# Altium project DC_Switch_Project.PrjPcb
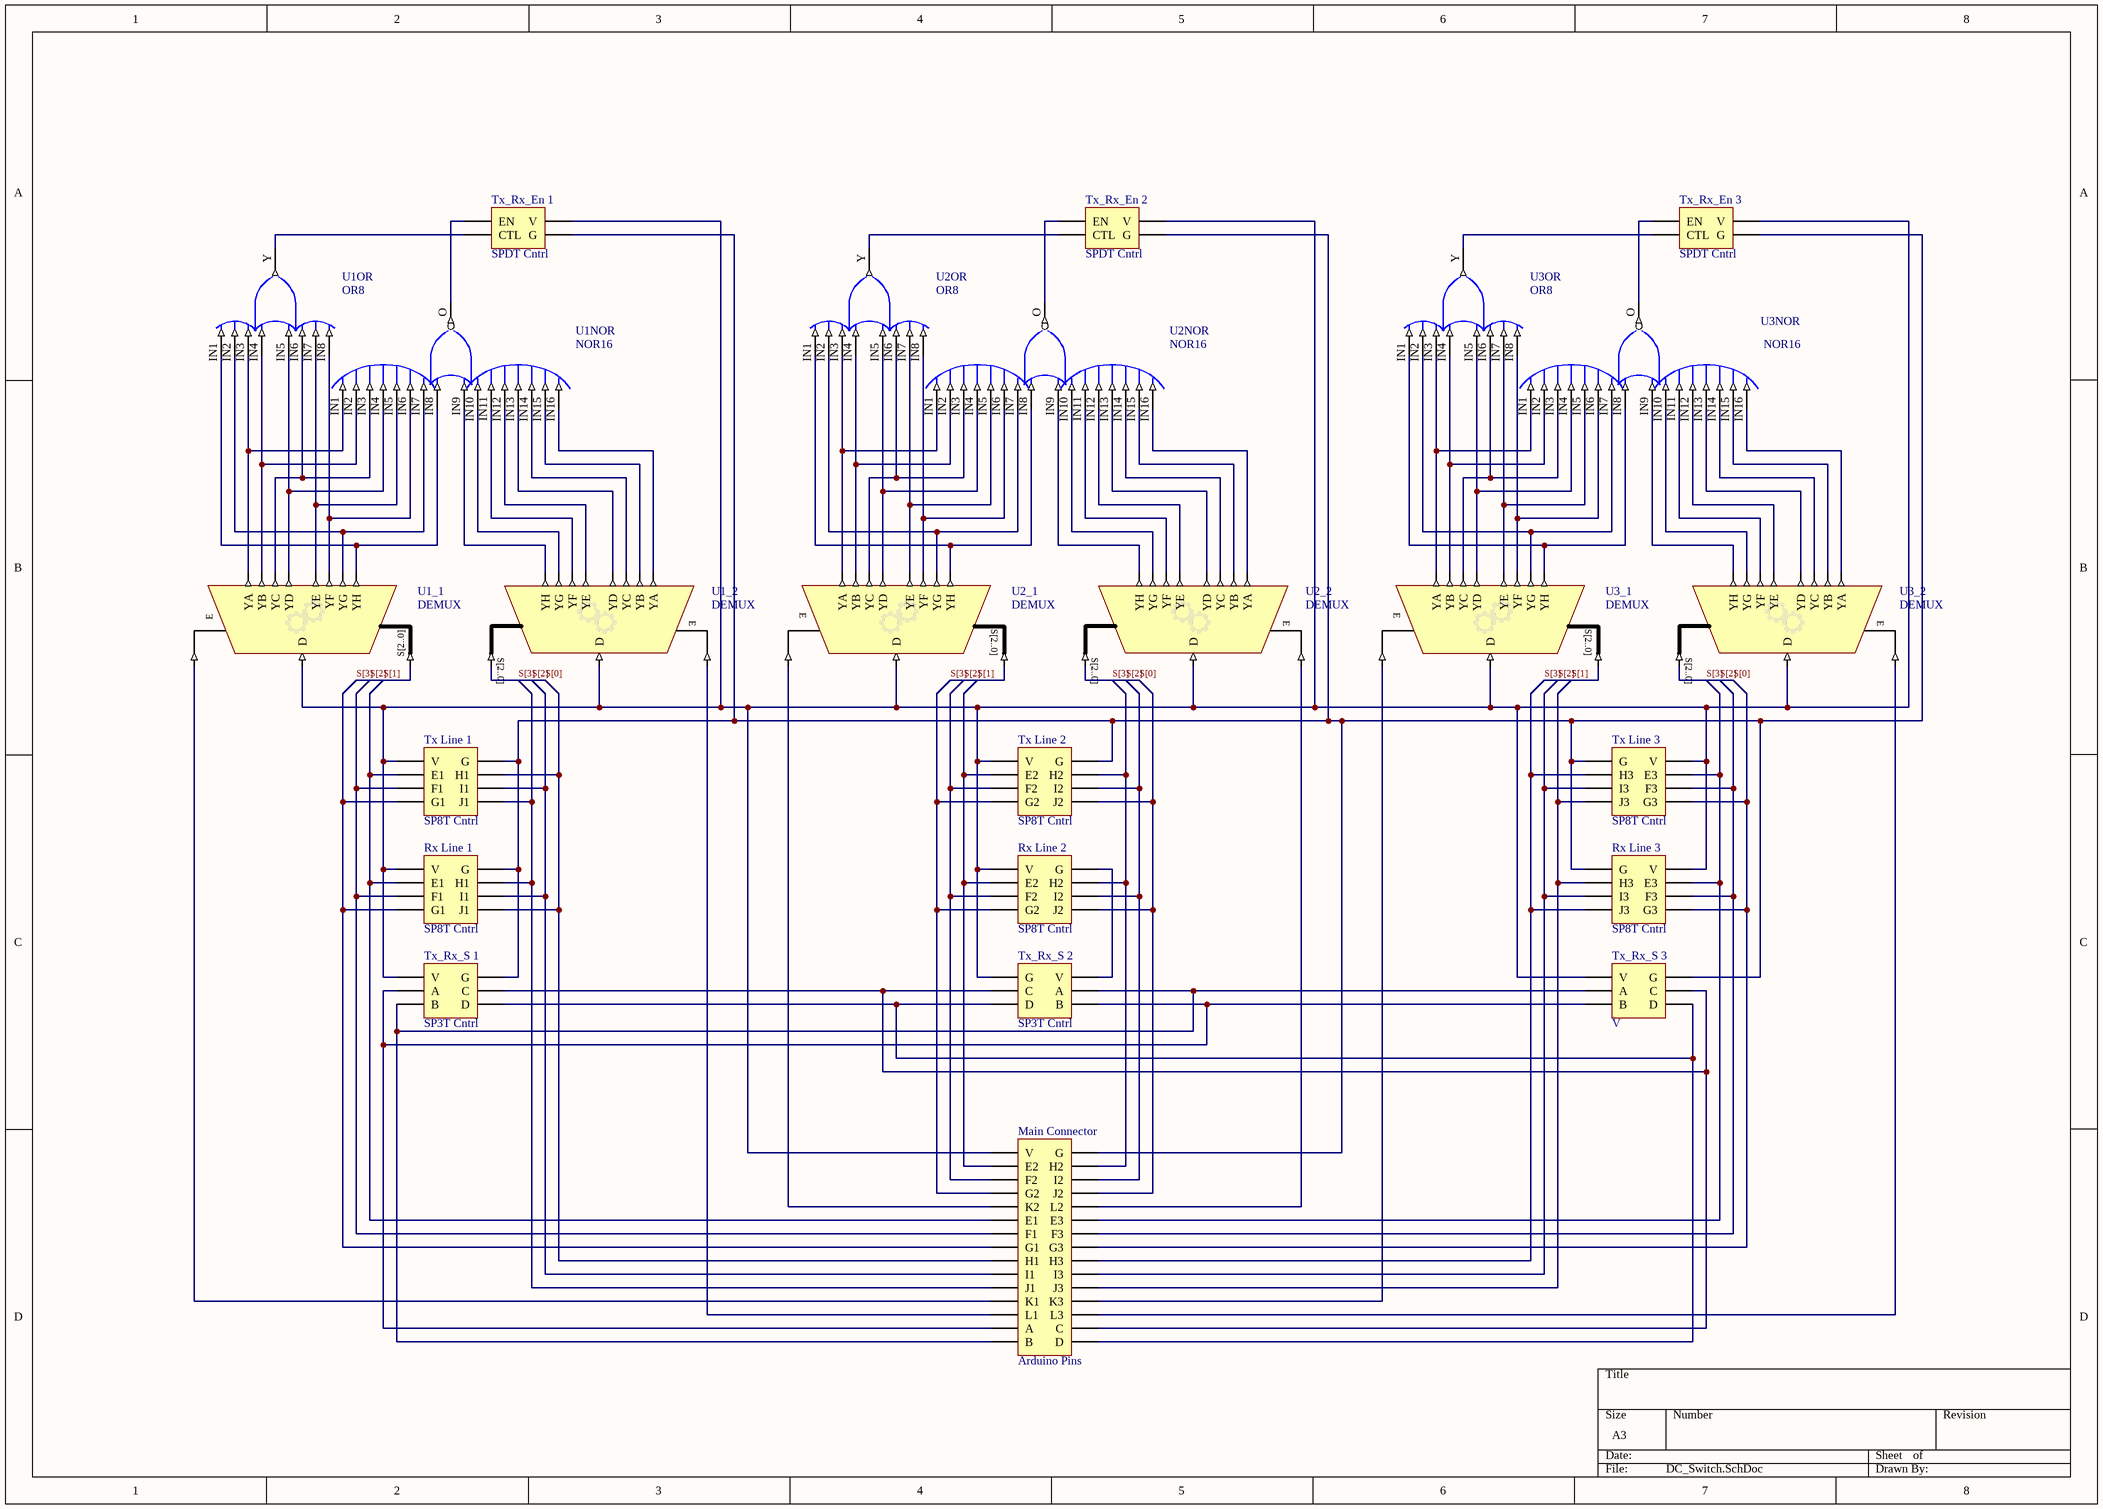
[diagram p0: DC_Switch.SchDoc]
1 sheet, 25 parts. Net scope: global (net labels, ports and power ports of the same name join across sheets).

## Sheet DC_Switch.SchDoc
size A3

### Parts
Main_Connector  Arduino Pins  [HDR2X15_CEN]
Rx_Line_1  SP8T Cntrl  [HDR2X4_CEN]
Rx_Line_2  SP8T Cntrl  [HDR2X4_CEN]
Rx_Line_3  SP8T Cntrl  [HDR2X4_CEN]
Tx_Line_1  SP8T Cntrl  [HDR2X4_CEN]
Tx_Line_2  SP8T Cntrl  [HDR2X4_CEN]
Tx_Line_3  SP8T Cntrl  [HDR2X4_CEN]
Tx_Rx_En_1  SPDT Cntrl  [HDR2X2]
Tx_Rx_En_2  SPDT Cntrl  [HDR2X2]
Tx_Rx_En_3  SPDT Cntrl  [HDR2X2]
Tx_Rx_S_1  SP3T Cntrl  [HDR2X3_CEN]
Tx_Rx_S_2  SP3T Cntrl  [HDR2X3_CEN]
Tx_Rx_S_3  V  [HDR2X3_CEN]
U1_1  DEMUX
U1_2  DEMUX
U1NOR  NOR16
U1OR  OR8
U2_1  DEMUX
U2_2  DEMUX
U2NOR  NOR16
U2OR  OR8
U3_1  DEMUX
U3_2  DEMUX
U3NOR  NOR16
U3OR  OR8

### Nets
S[0]: Main_Connector.9(H1) Main_Connector.19(J2) Main_Connector.23(G3) Rx_Line_1.8(J1) Rx_Line_2.8(J2) Rx_Line_3.8(G3) Tx_Line_1.6(H1) Tx_Line_2.8(J2) Tx_Line_3.8(G3)
S[1]: Main_Connector.2(E2) Main_Connector.6(E1) Main_Connector.26(J3) Rx_Line_1.2(E1) Rx_Line_2.2(E2) Rx_Line_3.2(H3) Tx_Line_1.2(E1) Tx_Line_2.2(E2) Tx_Line_3.4(J3)
S[2]: Main_Connector.3(F2) Main_Connector.7(F1) Main_Connector.10(I1) Main_Connector.18(I2) Main_Connector.22(F3) Main_Connector.25(I3) Rx_Line_1.3(F1) Rx_Line_1.7(I1) Rx_Line_2.3(F2) Rx_Line_2.7(I2) Rx_Line_3.3(I3) Rx_Line_3.7(F3) Tx_Line_1.3(F1) Tx_Line_1.7(I1) Tx_Line_2.3(F2) Tx_Line_2.7(I2) Tx_Line_3.3(I3) Tx_Line_3.7(F3)
S[3]: Main_Connector.4(G2) Main_Connector.8(G1) Main_Connector.11(J1) Main_Connector.17(H2) Main_Connector.21(E3) Main_Connector.24(H3) Rx_Line_1.4(G1) Rx_Line_1.6(H1) Rx_Line_2.4(G2) Rx_Line_2.6(H2) Rx_Line_3.4(J3) Rx_Line_3.6(E3) Tx_Line_1.4(G1) Tx_Line_1.8(J1) Tx_Line_2.4(G2) Tx_Line_2.6(H2) Tx_Line_3.2(H3) Tx_Line_3.6(E3)
NetMain_Connector_1: Main_Connector.1(V) Rx_Line_1.1(V) Rx_Line_2.1(V) Rx_Line_3.5(V) Tx_Line_1.1(V) Tx_Line_2.1(V) Tx_Line_3.5(V) Tx_Rx_En_1.2(V) Tx_Rx_En_2.2(V) Tx_Rx_En_3.2(V) Tx_Rx_S_1.1(V) Tx_Rx_S_2.4(G) Tx_Rx_S_3.1(V) U1_1.D U1_2.D U2_1.D U2_2.D U3_1.D U3_2.D
NetMain_Connector_5: Main_Connector.5(K2) U2_1.E
NetMain_Connector_12: Main_Connector.12(K1) U1_1.E
NetMain_Connector_13: Main_Connector.13(L1) U1_2.E
NetMain_Connector_14: Main_Connector.14(A) Tx_Rx_S_1.2(A) Tx_Rx_S_2.3(B) Tx_Rx_S_3.3(B)
NetMain_Connector_15: Main_Connector.15(B) Tx_Rx_S_1.3(B) Tx_Rx_S_2.2(A) Tx_Rx_S_3.2(A)
NetMain_Connector_16: Main_Connector.16(G) Rx_Line_1.5(G) Rx_Line_3.1(G) Tx_Line_1.5(G) Tx_Line_2.5(G) Tx_Line_3.1(G) Tx_Rx_En_1.4(G) Tx_Rx_En_2.4(G) Tx_Rx_En_3.4(G) Tx_Rx_S_1.4(G) Tx_Rx_S_3.4(G)
NetMain_Connector_20: Main_Connector.20(L2) U2_2.E
NetMain_Connector_27: Main_Connector.27(K3) U3_1.E
NetMain_Connector_28: Main_Connector.28(L3) U3_2.E
NetMain_Connector_29: Main_Connector.29(C) Tx_Rx_S_1.5(C) Tx_Rx_S_2.5(C) Tx_Rx_S_3.5(C)
NetMain_Connector_30: Main_Connector.30(D) Tx_Rx_S_1.6(D) Tx_Rx_S_2.6(D) Tx_Rx_S_3.6(D)
NetRx_Line_2_5: Rx_Line_2.5(G) Tx_Rx_S_2.1(V)
NetTx_Rx_En_1_1: Tx_Rx_En_1.1(EN) U1NOR.O
NetTx_Rx_En_1_3: Tx_Rx_En_1.3(CTL) U1OR.Y
NetTx_Rx_En_2_1: Tx_Rx_En_2.1(EN) U2NOR.O
NetTx_Rx_En_2_3: Tx_Rx_En_2.3(CTL) U2OR.Y
NetTx_Rx_En_3_1: Tx_Rx_En_3.1(EN) U3NOR.O
NetTx_Rx_En_3_3: Tx_Rx_En_3.3(CTL) U3OR.Y
NetU1_1_YA: U1_1.YA U1NOR.IN1 U1OR.IN3
NetU1_1_YB: U1_1.YB U1NOR.IN2 U1OR.IN4
NetU1_1_YC: U1_1.YC U1NOR.IN3 U1OR.IN6
NetU1_1_YD: U1_1.YD U1NOR.IN4 U1OR.IN5
NetU1_1_YE: U1_1.YE U1NOR.IN5 U1OR.IN7
NetU1_1_YF: U1_1.YF U1NOR.IN6 U1OR.IN8
NetU1_1_YG: U1_1.YG U1NOR.IN7 U1OR.IN2
NetU1_1_YH: U1_1.YH U1NOR.IN8 U1OR.IN1
NetU1_2_YA: U1_2.YA U1NOR.IN16
NetU1_2_YB: U1_2.YB U1NOR.IN15
NetU1_2_YC: U1_2.YC U1NOR.IN14
NetU1_2_YD: U1_2.YD U1NOR.IN13
NetU1_2_YE: U1_2.YE U1NOR.IN12
NetU1_2_YF: U1_2.YF U1NOR.IN11
NetU1_2_YG: U1_2.YG U1NOR.IN10
NetU1_2_YH: U1_2.YH U1NOR.IN9
NetU2_1_YA: U2_1.YA U2NOR.IN1 U2OR.IN3
NetU2_1_YB: U2_1.YB U2NOR.IN2 U2OR.IN4
NetU2_1_YC: U2_1.YC U2NOR.IN3 U2OR.IN6
NetU2_1_YD: U2_1.YD U2NOR.IN4 U2OR.IN5
NetU2_1_YE: U2_1.YE U2NOR.IN5 U2OR.IN7
NetU2_1_YF: U2_1.YF U2NOR.IN6 U2OR.IN8
NetU2_1_YG: U2_1.YG U2NOR.IN7 U2OR.IN2
NetU2_1_YH: U2_1.YH U2NOR.IN8 U2OR.IN1
NetU2_2_YA: U2_2.YA U2NOR.IN16
NetU2_2_YB: U2_2.YB U2NOR.IN15
NetU2_2_YC: U2_2.YC U2NOR.IN14
NetU2_2_YD: U2_2.YD U2NOR.IN13
NetU2_2_YE: U2_2.YE U2NOR.IN12
NetU2_2_YF: U2_2.YF U2NOR.IN11
NetU2_2_YG: U2_2.YG U2NOR.IN10
NetU2_2_YH: U2_2.YH U2NOR.IN9
NetU3_1_YA: U3_1.YA U3NOR.IN1 U3OR.IN3
NetU3_1_YB: U3_1.YB U3NOR.IN2 U3OR.IN4
NetU3_1_YC: U3_1.YC U3NOR.IN3 U3OR.IN6
NetU3_1_YD: U3_1.YD U3NOR.IN4 U3OR.IN5
NetU3_1_YE: U3_1.YE U3NOR.IN5 U3OR.IN7
NetU3_1_YF: U3_1.YF U3NOR.IN6 U3OR.IN8
NetU3_1_YG: U3_1.YG U3NOR.IN7 U3OR.IN2
NetU3_1_YH: U3_1.YH U3NOR.IN8 U3OR.IN1
NetU3_2_YA: U3_2.YA U3NOR.IN16
NetU3_2_YB: U3_2.YB U3NOR.IN15
NetU3_2_YC: U3_2.YC U3NOR.IN14
NetU3_2_YD: U3_2.YD U3NOR.IN13
NetU3_2_YE: U3_2.YE U3NOR.IN12
NetU3_2_YF: U3_2.YF U3NOR.IN11
NetU3_2_YG: U3_2.YG U3NOR.IN10
NetU3_2_YH: U3_2.YH U3NOR.IN9

Not connected (* = marked no-connect by the designer): U1_1 S[2..0]; U1_2 S[2..0]; U2_1 S[2..0]; U2_2 S[2..0]; U3_1 S[2..0]; U3_2 S[2..0]

### Library data of the parts
Main_Connector = Header 15X2A: Header, 15-Pin, Dual row; LatestRevisionDate: 17-Jul-2002; LatestRevisionNote: Re-released for DXP Platform.; Publisher: Altium Limited
Rx_Line_1-Rx_Line_3 Tx_Line_1-Tx_Line_3 = Header 4X2A: Header, 4-Pin, Dual row; LatestRevisionDate: 17-Jul-2002; LatestRevisionNote: Re-released for DXP Platform.; Publisher: Altium Limited
Tx_Rx_En_1-Tx_Rx_En_3 = Header 2X2: Header, 2-Pin, Dual row; LatestRevisionDate: 17-Jul-2002; LatestRevisionNote: Re-released for DXP Platform.; Publisher: Altium Limited
Tx_Rx_S_1-Tx_Rx_S_3 = Header 3X2A: Header, 3-Pin, Dual row; LatestRevisionDate: 17-Jul-2002; LatestRevisionNote: Re-released for DXP Platform.; Publisher: Altium Limited
U1_1 U1_2 U2_1 U2_2 U3_1 U3_2 = DEMUX: Configurable Demutliplexer; ConfigurationParameters: {}Version[1.0]{}ShowEnable[True]{}BusInputs[False]{}BusOutputs[False]{}SignalWidth[1]{}Type[Demultiplexer]{}RegisterOutputs[False]{}NegativeClockEdge[False]{}ShowPinNames[True]{}InvertSingleSignal[False]{}SignalCount[8]{}Invert0[False]{}Invert1[False]{}Invert2[False]{}Invert3[False]{}Invert4[False]{}Invert5[False]{}Invert6[False]{}Invert7[False]{}; ConfiguratorName: GENERIC_MULTIPLEXER; LastRevisionNo: 1.00.00; Published: 31-Dec-2008; Publisher: Altium Limited
U1NOR U2NOR U3NOR = NOR16: 16-Input NOR Gate; FPGAVendor: Altera; Published: 17-Apr-2002; Publisher: Altium Limited
U1OR U2OR U3OR = OR8: 8-Input OR Gate; FPGAVendor: Altera; Published: 17-Apr-2002; Publisher: Altium Limited